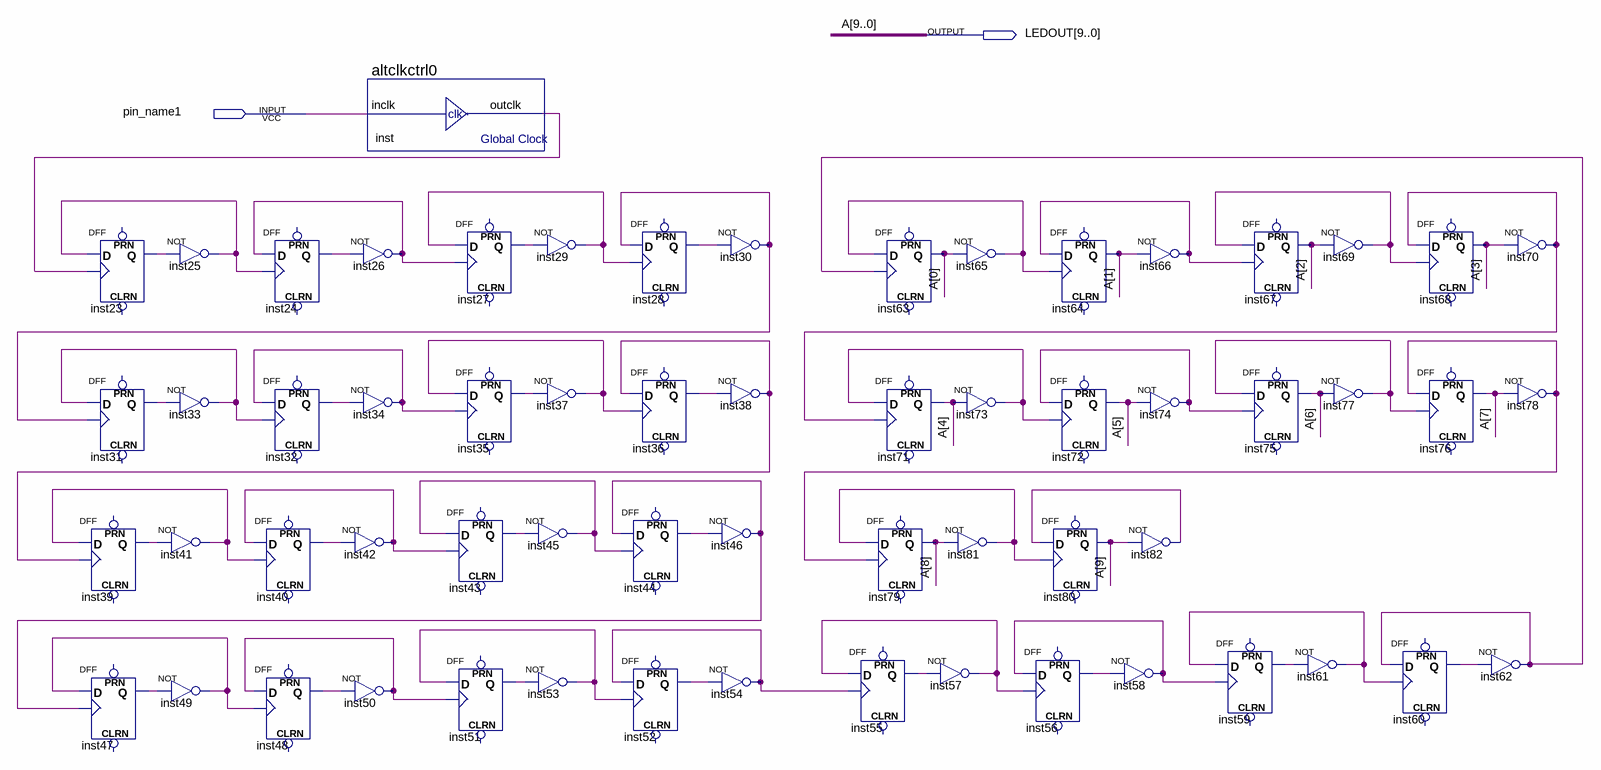
[diagram p0: schematic sheet]
// Quartus schematic blinken_Lights.bdf as structural Verilog: 61 symbols, 2 pins
module blinken_Lights (
  input  pin_name1,
  output [9:0] LEDOUT
);

  wire inst23_q, inst24_q, inst25_out, inst26_out, inst27_q, inst28_q, inst29_out, inst30_out, inst31_q,
       inst32_q, inst33_out, inst34_out, inst35_q, inst36_q, inst37_out, inst38_out, inst39_q, inst40_q,
       inst41_out, inst42_out, inst43_q, inst44_q, inst45_out, inst46_out, inst47_q, inst48_q, inst49_out,
       inst50_out, inst51_q, inst52_q, inst53_out, inst54_out, inst55_q, inst56_q, inst57_out, inst58_out,
       inst59_q, inst60_q, inst61_out, inst62_out, inst65_out, inst66_out, inst69_out, inst70_out,
       inst73_out, inst74_out, inst77_out, inst78_out, inst81_out, inst82_out, inst_outclk;

  DFF inst23 (.CLK(inst_outclk), .D(inst25_out), .Q(inst23_q));  // open: CLRN, PRN
  DFF inst31 (.CLK(inst30_out), .D(inst33_out), .Q(inst31_q));  // open: CLRN, PRN
  DFF inst39 (.CLK(inst38_out), .D(inst41_out), .Q(inst39_q));  // open: CLRN, PRN
  DFF inst47 (.CLK(inst46_out), .D(inst49_out), .Q(inst47_q));  // open: CLRN, PRN
  not inst25 (inst25_out, inst23_q);
  not inst33 (inst33_out, inst31_q);
  not inst41 (inst41_out, inst39_q);
  not inst49 (inst49_out, inst47_q);
  DFF inst40 (.CLK(inst41_out), .D(inst42_out), .Q(inst40_q));  // open: CLRN, PRN
  DFF inst48 (.CLK(inst49_out), .D(inst50_out), .Q(inst48_q));  // open: CLRN, PRN
  DFF inst24 (.CLK(inst25_out), .D(inst26_out), .Q(inst24_q));  // open: CLRN, PRN
  DFF inst32 (.CLK(inst33_out), .D(inst34_out), .Q(inst32_q));  // open: CLRN, PRN
  altclkctrl0 inst (.inclk(pin_name1), .outclk(inst_outclk));
  not inst26 (inst26_out, inst24_q);
  not inst34 (inst34_out, inst32_q);
  not inst42 (inst42_out, inst40_q);
  not inst50 (inst50_out, inst48_q);
  DFF inst27 (.CLK(inst26_out), .D(inst29_out), .Q(inst27_q));  // open: CLRN, PRN
  DFF inst35 (.CLK(inst34_out), .D(inst37_out), .Q(inst35_q));  // open: CLRN, PRN
  DFF inst43 (.CLK(inst42_out), .D(inst45_out), .Q(inst43_q));  // open: CLRN, PRN
  DFF inst51 (.CLK(inst50_out), .D(inst53_out), .Q(inst51_q));  // open: CLRN, PRN
  not inst29 (inst29_out, inst27_q);
  not inst37 (inst37_out, inst35_q);
  not inst45 (inst45_out, inst43_q);
  not inst53 (inst53_out, inst51_q);
  DFF inst28 (.CLK(inst29_out), .D(inst30_out), .Q(inst28_q));  // open: CLRN, PRN
  DFF inst36 (.CLK(inst37_out), .D(inst38_out), .Q(inst36_q));  // open: CLRN, PRN
  DFF inst44 (.CLK(inst45_out), .D(inst46_out), .Q(inst44_q));  // open: CLRN, PRN
  DFF inst52 (.CLK(inst53_out), .D(inst54_out), .Q(inst52_q));  // open: CLRN, PRN
  not inst30 (inst30_out, inst28_q);
  not inst38 (inst38_out, inst36_q);
  not inst46 (inst46_out, inst44_q);
  not inst54 (inst54_out, inst52_q);
  DFF inst63 (.CLK(inst62_out), .D(inst65_out), .Q(LEDOUT[0]));  // open: CLRN, PRN
  DFF inst71 (.CLK(inst70_out), .D(inst73_out), .Q(LEDOUT[4]));  // open: CLRN, PRN
  DFF inst79 (.CLK(inst78_out), .D(inst81_out), .Q(LEDOUT[8]));  // open: CLRN, PRN
  DFF inst55 (.CLK(inst54_out), .D(inst57_out), .Q(inst55_q));  // open: CLRN, PRN
  not inst65 (inst65_out, LEDOUT[0]);
  not inst73 (inst73_out, LEDOUT[4]);
  not inst81 (inst81_out, LEDOUT[8]);
  not inst57 (inst57_out, inst55_q);
  DFF inst56 (.CLK(inst57_out), .D(inst58_out), .Q(inst56_q));  // open: CLRN, PRN
  DFF inst64 (.CLK(inst65_out), .D(inst66_out), .Q(LEDOUT[1]));  // open: CLRN, PRN
  DFF inst72 (.CLK(inst73_out), .D(inst74_out), .Q(LEDOUT[5]));  // open: CLRN, PRN
  DFF inst80 (.CLK(inst81_out), .D(inst82_out), .Q(LEDOUT[9]));  // open: CLRN, PRN
  not inst66 (inst66_out, LEDOUT[1]);
  not inst74 (inst74_out, LEDOUT[5]);
  not inst82 (inst82_out, LEDOUT[9]);
  not inst58 (inst58_out, inst56_q);
  DFF inst59 (.CLK(inst58_out), .D(inst61_out), .Q(inst59_q));  // open: CLRN, PRN
  DFF inst67 (.CLK(inst66_out), .D(inst69_out), .Q(LEDOUT[2]));  // open: CLRN, PRN
  DFF inst75 (.CLK(inst74_out), .D(inst77_out), .Q(LEDOUT[6]));  // open: CLRN, PRN
  not inst61 (inst61_out, inst59_q);
  not inst69 (inst69_out, LEDOUT[2]);
  not inst77 (inst77_out, LEDOUT[6]);
  DFF inst68 (.CLK(inst69_out), .D(inst70_out), .Q(LEDOUT[3]));  // open: CLRN, PRN
  DFF inst76 (.CLK(inst77_out), .D(inst78_out), .Q(LEDOUT[7]));  // open: CLRN, PRN
  DFF inst60 (.CLK(inst61_out), .D(inst62_out), .Q(inst60_q));  // open: CLRN, PRN
  not inst70 (inst70_out, LEDOUT[3]);
  not inst78 (inst78_out, LEDOUT[7]);
  not inst62 (inst62_out, inst60_q);

  // Other names for the same wires on the sheet: A[9:0] = LEDOUT
endmodule
